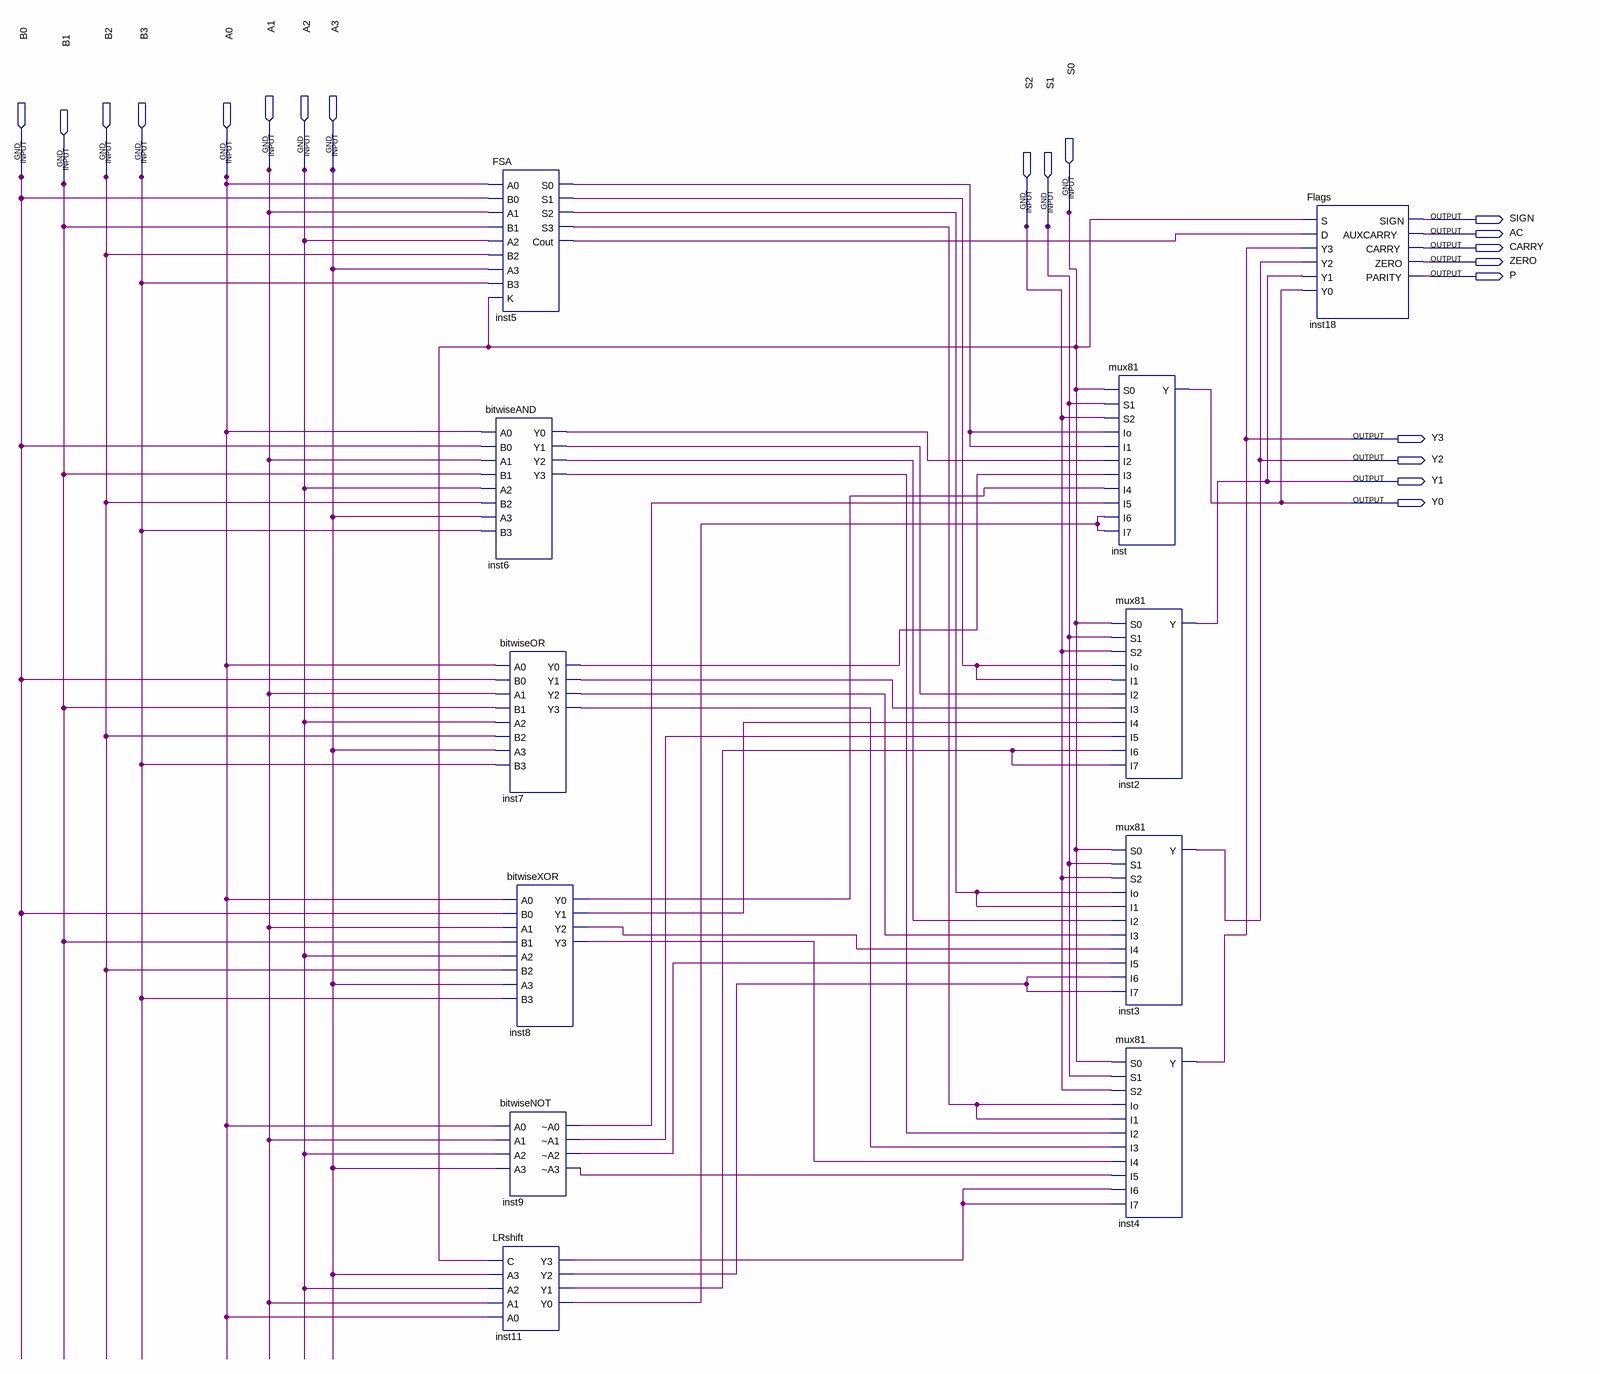
[diagram p0: schematic sheet]
// Quartus schematic ALUUUU.bdf as structural Verilog: 11 symbols, 20 pins
module ALUUUU (
  input  A1,
  input  A2,
  input  A3,
  input  B0,
  input  B2,
  input  B3,
  input  A0,
  input  B1,
  input  S0,
  input  S2,
  input  S1,
  output SIGN,
  output AC,
  output CARRY,
  output ZERO,
  output P,
  output Y3,
  output Y2,
  output Y1,
  output Y0
);

  wire inst5_cout, inst5_s0, inst5_s1, inst5_s2, inst5_s3, inst6_y0, inst6_y1, inst6_y2, inst6_y3, inst7_y0,
       inst7_y1, inst7_y2, inst7_y3, inst8_y0, inst8_y1, inst8_y2, inst8_y3, inst9__a0, inst9__a1, inst9__a2,
       inst9__a3, inst11_y0, inst11_y1, inst11_y2, inst11_y3;

  FSA inst5 (
    .A0(A0), .B0(B0), .A1(A1), .B1(B1), .A2(A2), .B2(B2), .A3(A3), .B3(B3), .K(S0), .S0(inst5_s0),
    .S1(inst5_s1), .S2(inst5_s2), .S3(inst5_s3), .Cout(inst5_cout));
  bitwiseAND inst6 (
    .A0(A0), .B0(B0), .A1(A1), .B1(B1), .A2(A2), .B2(B2), .A3(A3), .B3(B3), .Y0(inst6_y0), .Y1(inst6_y1),
    .Y2(inst6_y2), .Y3(inst6_y3));
  bitwiseOR inst7 (
    .A0(A0), .B0(B0), .A1(A1), .B1(B1), .A2(A2), .B2(B2), .A3(A3), .B3(B3), .Y0(inst7_y0), .Y1(inst7_y1),
    .Y2(inst7_y2), .Y3(inst7_y3));
  bitwiseXOR inst8 (
    .A0(A0), .B0(B0), .A1(A1), .B1(B1), .A2(A2), .B2(B2), .A3(A3), .B3(B3), .Y0(inst8_y0), .Y1(inst8_y1),
    .Y2(inst8_y2), .Y3(inst8_y3));
  bitwiseNOT inst9 (
    .A0(A0), .A1(A1), .A2(A2), .A3(A3), .\~A0 (inst9__a0), .\~A1 (inst9__a1), .\~A2 (inst9__a2),
    .\~A3 (inst9__a3));
  LRshift inst11 (
    .C(S0), .A3(A3), .A2(A2), .A1(A1), .A0(A0), .Y3(inst11_y3), .Y2(inst11_y2), .Y1(inst11_y1), .Y0(inst11_y0));
  mux81 inst (
    .S0(S0), .S1(S1), .S2(S2), .Io(inst5_s0), .I1(inst5_s0), .I2(inst6_y0), .I3(inst7_y0), .I4(inst8_y0),
    .I5(inst9__a0), .I6(inst11_y0), .I7(inst11_y0), .Y(Y0));
  mux81 inst2 (
    .S0(S0), .S1(S1), .S2(S2), .Io(inst5_s1), .I1(inst5_s1), .I2(inst6_y1), .I3(inst7_y1), .I4(inst8_y1),
    .I5(inst9__a1), .I6(inst11_y1), .I7(inst11_y1), .Y(Y1));
  mux81 inst3 (
    .S0(S0), .S1(S1), .S2(S2), .Io(inst5_s2), .I1(inst5_s2), .I2(inst6_y2), .I3(inst7_y2), .I4(inst8_y2),
    .I5(inst9__a2), .I6(inst11_y2), .I7(inst11_y2), .Y(Y2));
  mux81 inst4 (
    .S0(S0), .S1(S1), .S2(S2), .Io(inst5_s3), .I1(inst5_s3), .I2(inst6_y3), .I3(inst7_y3), .I4(inst8_y3),
    .I5(inst9__a3), .I6(inst11_y3), .I7(inst11_y3), .Y(Y3));
  Flags inst18 (
    .S(S0), .D(inst5_cout), .Y3(Y3), .Y2(Y2), .Y1(Y1), .Y0(Y0), .SIGN(SIGN), .AUXCARRY(AC), .CARRY(CARRY),
    .ZERO(ZERO), .PARITY(P));
endmodule
